# Altium schematic sheet hs_switch.SchDoc: HS Switch
size A4; Organization: GPA Robotics; DocumentNumber: 6; Revision: REV 0; SheetNumber: 6; SheetTotal: 11
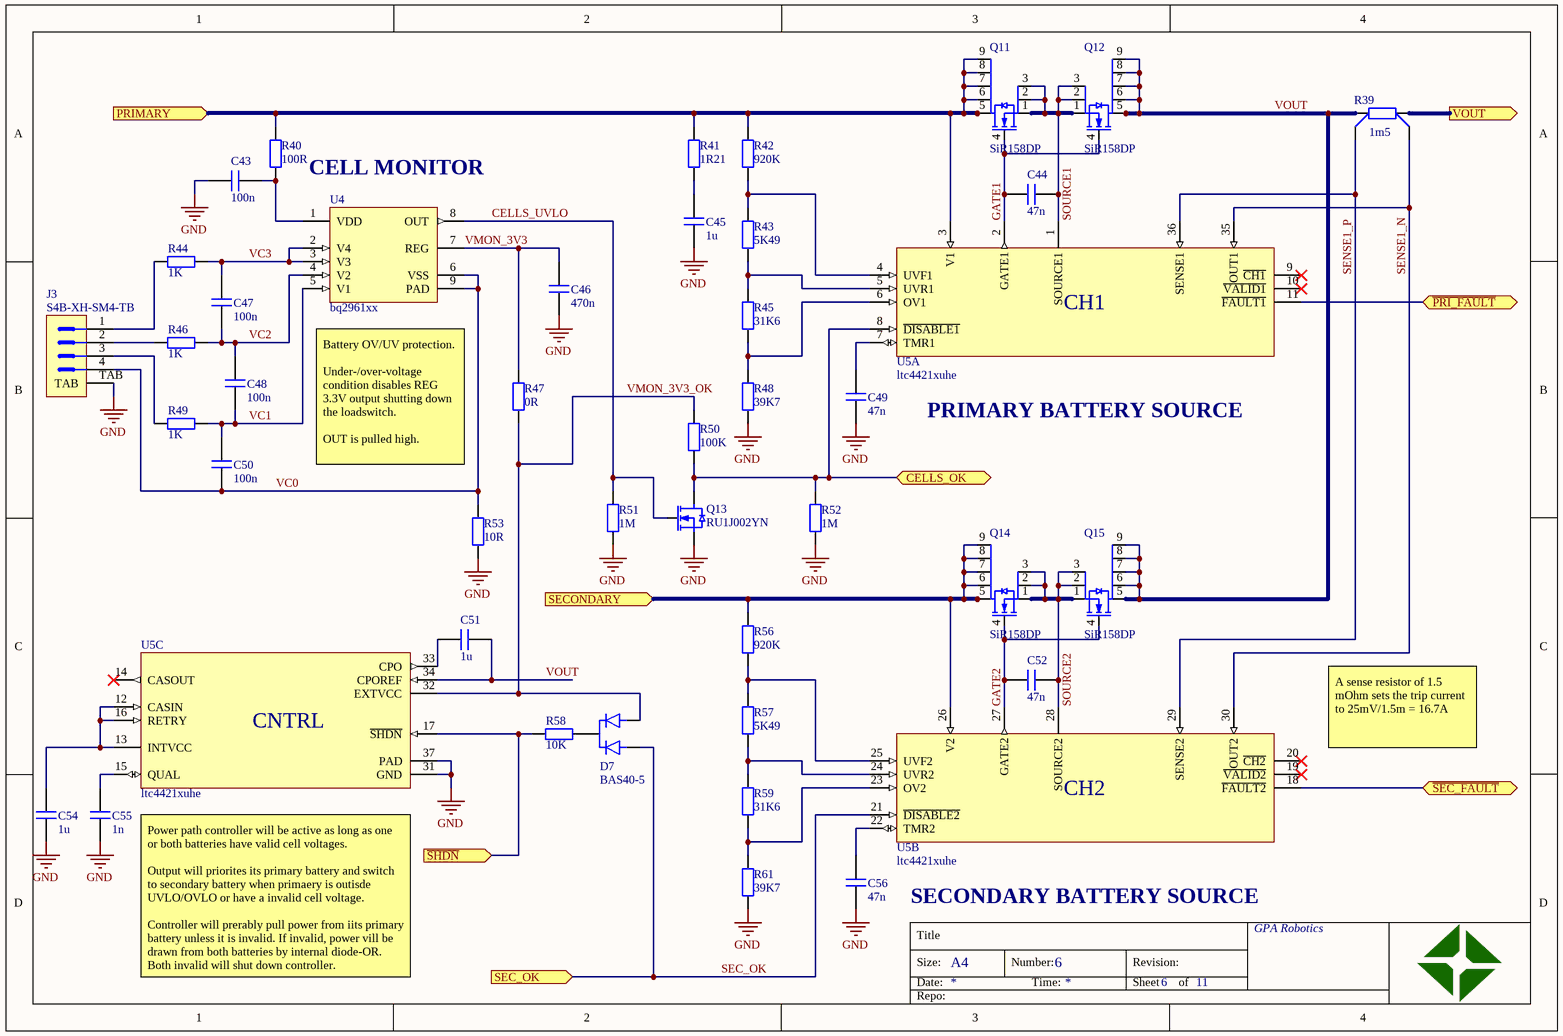
[diagram p0: hs_switch.SchDoc]

## Parts
C43  value 100n  [CAPC1005X06N]  (hidden comment: cap)
C44  value 47n  [CAPC1005X06N]  (hidden comment: cap)
C45  value 1u  [CAPC2012X11N]  (hidden comment: cap)
C46  value 470n  [CAPC2012X11N]  (hidden comment: cap)
C47  value 100n  [CAPC1005X06N]  (hidden comment: cap)
C48  value 100n  [CAPC1005X06N]  (hidden comment: cap)
C49  value 47n  [CAPC1005X06N]  (hidden comment: cap)
C50  value 100n  [CAPC1005X06N]  (hidden comment: cap)
C51  value 1u  [CAPC2012X11N]  (hidden comment: cap)
C52  value 47n  [CAPC1005X06N]  (hidden comment: cap)
C54  value 1u  [CAPC2012X11N]  (hidden comment: cap)
C55  value 1n  [CAPC1005X06N]  (hidden comment: cap)
C56  value 47n  [CAPC1005X06N]  (hidden comment: cap)
D7  BAS40-5  [SOT23_CC]
J3  S4B-XH-SM4-TB  [S4B-XH-SM4-TB]
Q11  SiR158DP  [SON127P620X112_HS-9N_POWERPAK_SO8]
Q12  SiR158DP  [SON127P620X112_HS-9N_POWERPAK_SO8]
Q13  RU1J002YN  [SOTFL65P210X105-3N]
Q14  SiR158DP  [SON127P620X112_HS-9N_POWERPAK_SO8]
Q15  SiR158DP  [SON127P620X112_HS-9N_POWERPAK_SO8]
R39  value 1m5  [4T_RESC1632X05N]  (hidden comment: res_4t)
R40  value 100R  [RESC1005X04N]  (hidden comment: res)
R41  value 1R21  [RESC1005X04N]  (hidden comment: res)
R42  value 920K  [RESC1005X04N]  (hidden comment: res)
R43  value 5K49  [RESC1005X04N]  (hidden comment: res)
R44  value 1K  [RESC1005X04N]  (hidden comment: res)
R45  value 31K6  [RESC1005X04N]  (hidden comment: res)
R46  value 1K  [RESC1005X04N]  (hidden comment: res)
R47  value 0R  [RESC1005X04N]  (hidden comment: res)
R48  value 39K7  [RESC1005X04N]  (hidden comment: res)
R49  value 1K  [RESC1005X04N]  (hidden comment: res)
R50  value 100K  [RESC1005X04N]  (hidden comment: res)
R51  value 1M  [RESC1005X04N]  (hidden comment: res)
R52  value 1M  [RESC1005X04N]  (hidden comment: res)
R53  value 10R  [RESC1005X04N]  (hidden comment: res)
R56  value 920K  [RESC1005X04N]  (hidden comment: res)
R57  value 5K49  [RESC1005X04N]  (hidden comment: res)
R58  value 10K  [RESC1005X04N]  (hidden comment: res)
R59  value 31K6  [RESC1005X04N]  (hidden comment: res)
R61  value 39K7  [RESC1005X04N]  (hidden comment: res)
U4  bq2961xx  [SON50P200X80_HS-9N-BQ2960XX]
U5  ltc4421xuhe  [QFN50P500X600X80_HS-37N_LTC4421]  (parts A,B,C of 3)

## Ports
CELLS_OK (bidir), PRIMARY (in), SEC_OK (in), SECONDARY (in), VOUT (out), ~{PRI_FAULT} (bidir), ~{SEC_FAULT} (bidir), ~{SHDN} (in)

## Nets
GND: C43.1 C45.1 C46.1 C49.1 C54.1 C55.1 C56.1 J3.TAB Q13.2(S) R48.1 R51.1 R52.1 R53.2 R61.1 U5.31(GND) U5.37(PAD)
~{PRI_FAULT}: U5.11(~{FAULT1}) ; port ~{PRI_FAULT}
~{SEC_FAULT}: U5.18(~{FAULT2}) ; port ~{SEC_FAULT}
~{SHDN}: R58.1 U5.17(~{SHDN}) ; port ~{SHDN}
CELLS_OK: Q13.3(D) R50.1 R52.2 U5.8(~{DISABLE1}) ; port CELLS_OK
CELLS_UVLO: Q13.1(G) R51.2 U4.8(OUT)
GATE1: C44.1 Q11.4(G) Q12.4(G) U5.2(GATE1)
GATE2: C52.1 Q14.4(G) Q15.4(G) U5.27(GATE2)
PRIMARY: Q11.5(D) Q11.6(D) Q11.7(D) Q11.8(D) Q11.9(D) R40.2 R41.2 R42.2 U5.3(V1) ; port PRIMARY
SEC_OK: D7.A1 U5.21(~{DISABLE2}) ; port SEC_OK
SECONDARY: Q14.5(D) Q14.6(D) Q14.7(D) Q14.8(D) Q14.9(D) R56.2 U5.26(V2) ; port SECONDARY
SENSE1_N: R39.4 U5.30(OUT2) U5.35(OUT1)
SENSE1_P: R39.3 U5.29(SENSE2) U5.36(SENSE1)
SOURCE1: C44.2 Q11.1(S) Q11.2(S) Q11.3(S) Q12.1(S) Q12.2(S) Q12.3(S) U5.1(SOURCE1)
SOURCE2: C52.2 Q14.1(S) Q14.2(S) Q14.3(S) Q15.1(S) Q15.2(S) Q15.3(S) U5.28(SOURCE2)
VC0: C50.1 J3.4 R53.1 U4.6(VSS) U4.9(PAD)
VC1: C48.1 C50.2 R49.2 U4.5(V1)
VC2: C47.1 C48.2 R46.2 U4.4(V2)
VC3: C47.2 R44.2 U4.2(V4) U4.3(V3)
VMON_3V3: C46.2 R47.2 U4.7(REG)
VMON_3V3_OK: D7.A2 R47.1 R50.2 U5.32(EXTVCC)
VOUT: C51.2 Q12.5(D) Q12.6(D) Q12.7(D) Q12.8(D) Q12.9(D) Q15.5(D) Q15.6(D) Q15.7(D) Q15.8(D) Q15.9(D) R39.1 U5.34(CPOREF)
VOUT: R39.2 ; port VOUT  [a separate net that carries the same name]
NetC43_2: C43.2 R40.1 U4.1(VDD)
NetC45_2: C45.2 R41.1
NetC49_2: C49.2 U5.7(TMR1)
NetC51_1: C51.1 U5.33(CPO)
NetC54_2: C54.2 U5.12(CASIN) U5.13(INTVCC) U5.16(RETRY)
NetC55_2: C55.2 U5.15(QUAL)
NetC56_2: C56.2 U5.22(TMR2)
NetD7_C: D7.C R58.2
NetJ3_1: J3.1 R44.1
NetJ3_2: J3.2 R46.1
NetJ3_3: J3.3 R49.1
NetR42_1: R42.1 R43.2 U5.4(UVF1)
NetR43_1: R43.1 R45.2 U5.5(UVR1)
NetR45_1: R45.1 R48.2 U5.6(OV1)
NetR56_1: R56.1 R57.2 U5.25(UVF2)
NetR57_1: R57.1 R59.2 U5.24(UVR2)
NetR59_1: R59.1 R61.2 U5.23(OV2)

Not connected (* = marked no-connect by the designer): U5 9(~{CH1})* 10(~{VALID1})* 14(CASOUT)* 19(~{VALID2})* 20(~{CH2})*

## Notes on the sheet
- CELL MONITOR
- PRIMARY BATTERY SOURCE
- Battery OV/UV protection.
  Under-/over-voltage condition disables REG 3.3V output shutting down the loadswitch.
  OUT is pulled high.
- A sense resistor of 1.5 mOhm sets the trip current to 25mV/1.5m = 16.7A
- SECONDARY BATTERY SOURCE
- Power path controller will be active as long as one or both batteries have valid cell voltages.
  Output will priorites its primary battery and switch to secondary battery when primaery is outisde UVLO/OVLO or have a invalid cell voltage.
  Controller will prerably pull power from iits primary battery unless it is invalid. If invalid, power vill be drawn from both batteries by internal diode-OR. Both invalid will shut down controller.
- Title
- Size:
- Date:
- A4
- Number:
- Time:
- Revision:
- Sheet
- of
- Repo:
- (in symbol ltc4421xuhe, part A) CH1
- (in symbol ltc4421xuhe, part B) CH2
- (in symbol ltc4421xuhe, part C) CNTRL

## Library data of the parts
C43-C52 C54-C56 = cap: Capacitor; voltage: *; type: *; #digikey: *; #mouser: *
D7 = diode_dual_cc: Diode Common Cathode
J3 = s4b-xh-sm4-tb: 2.5mm pitch/Disconnectable Crimp style connectors; ComponentLink1Description: datasheet; ComponentLink1URL: http://www.jst-mfg.com/product/pdf/eng/eXH.pdf
Q11 Q12 Q14 Q15 = sir158dp: N-Channel 30 V (D-S) MOSFET; ComponentLink1Description: datasheet; ComponentLink1URL: https://www.vishay.com/docs/64730/sir158dp.pdf
Q13 = ru1j002yn: N-channel 50V 200mA Small signal MOSFET; ComponentLink1Description: datasheet; ComponentLink1URL: https://www.mouser.se/datasheet/2/348/ru1j002yn-e-1018335.pdf
R39 = res_4t: Resistor; power: *; #digikey: *; #mouser: *
R40-R53 R56-R59 R61 = res: Resistor; power: *; voltage: *; #digikey: *; #mouser: *
U4 = bq2961xx: BQ296xxx Overvoltage Protection for 2-Series, 3-Series, and 4-Series Cell Li-Ion Batteries with Regulated Output Supply; ComponentLink1Description: datasheet; ComponentLink1URL: http://www.ti.com/lit/ds/symlink/bq2962.pdf
U5 = ltc4421xuhe: High Power Prioritized PowerPath Controller; ComponentLink1Description: datasheet; ComponentLink1URL: https://www.analog.com/media/en/technical-documentation/data-sheets/LTC4421.pdf